# EAGLE design lt8471 (EAGLE 9.5.1)
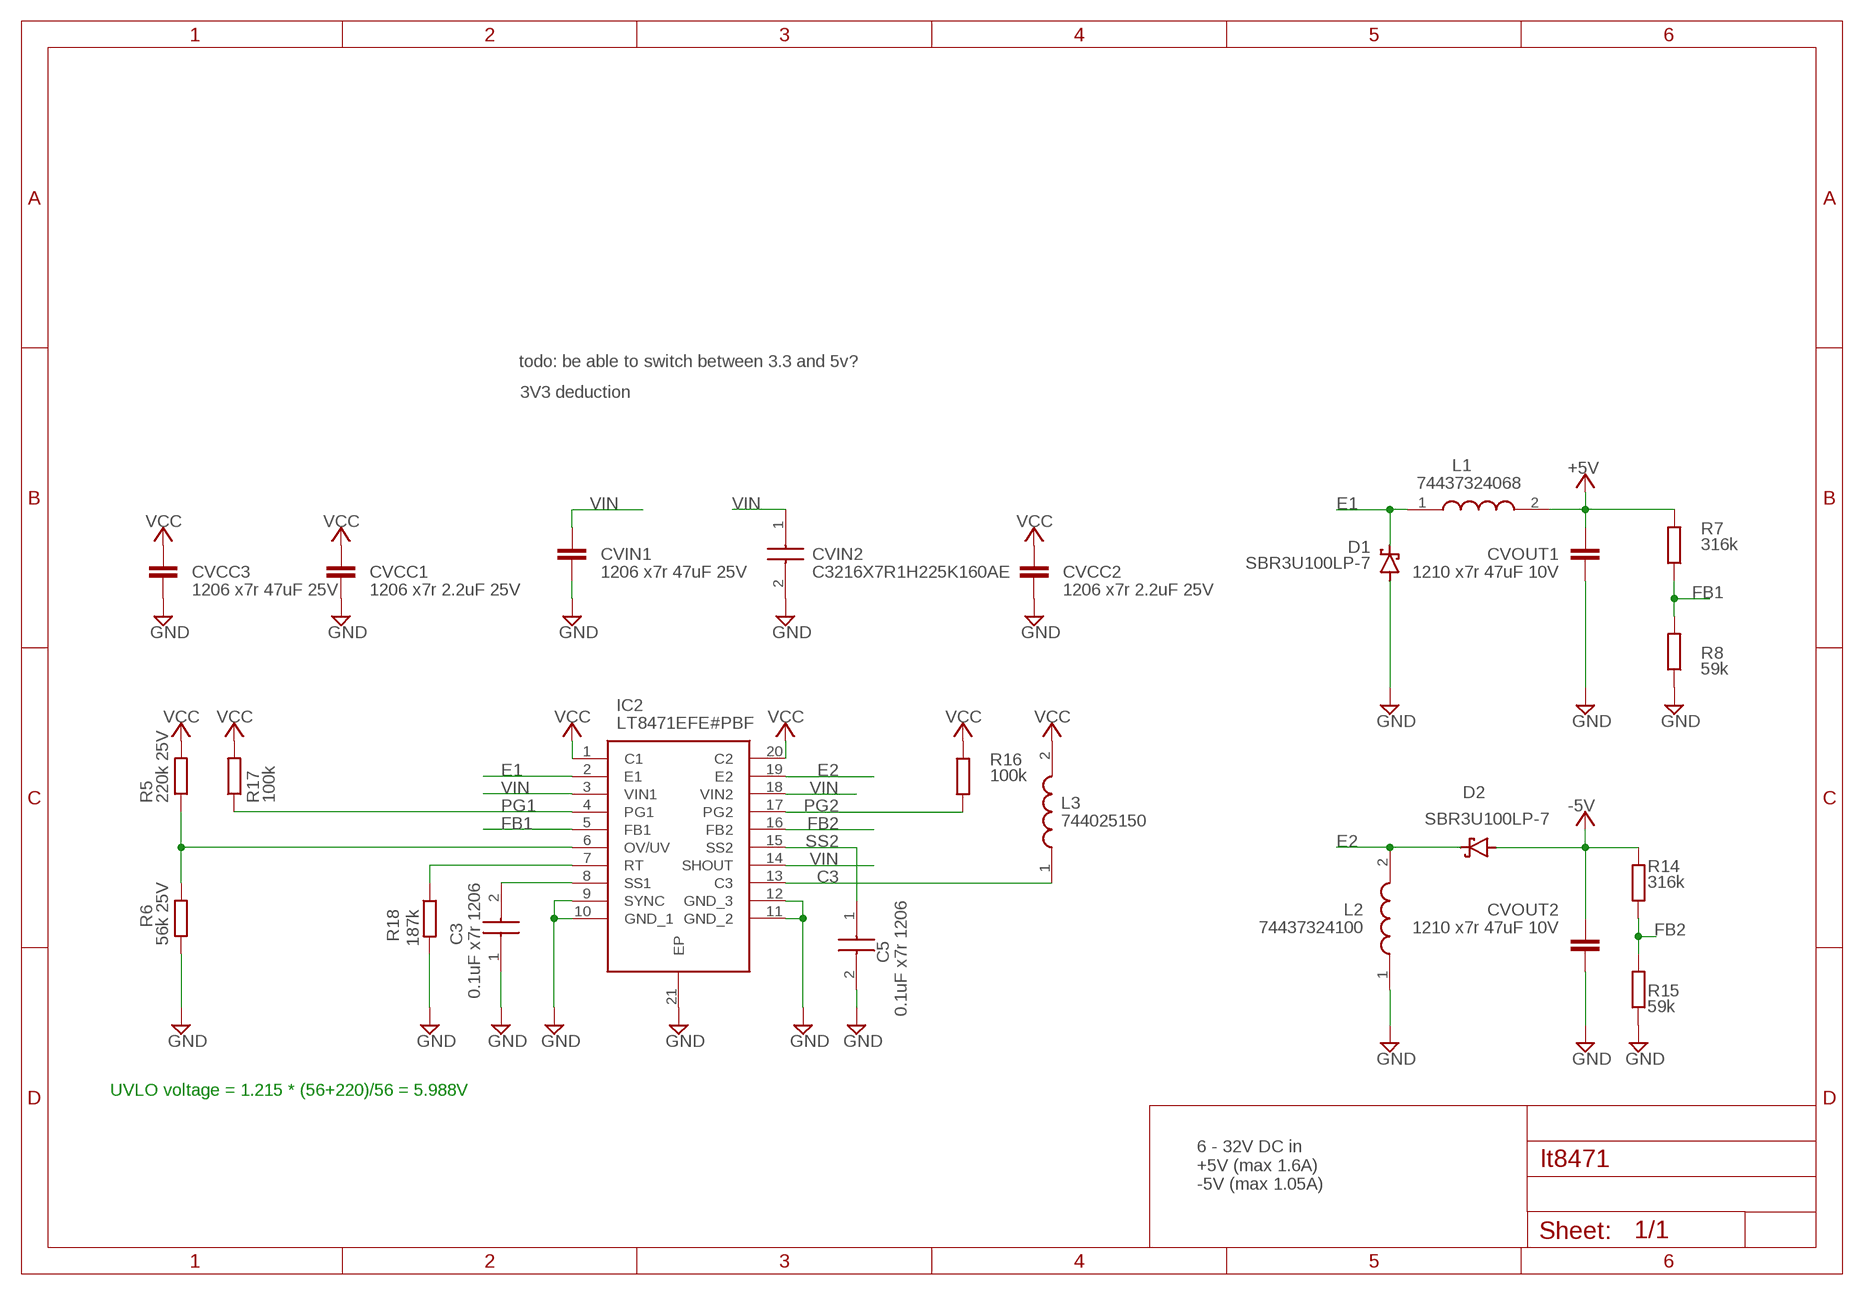
[diagram p0: schematic, sheet 1]

## Parts
C3  0.1uF x7r 1206  MCSH31B104K500CT  [CAPC3416X90N]
C5  0.1uF x7r 1206  MCSH31B104K500CT  [CAPC3416X90N]
CVCC1  1206 x7r 2.2uF 25V  C-EUC1206  [C1206]
CVCC2  1206 x7r 2.2uF 25V  C-EUC1206  [C1206]
CVCC3  1206 x7r 47uF 25V  C-EUC1210  [C1210]
CVIN1  1206 x7r 47uF 25V  C-EUC1210  [C1210]
CVIN2  C3216X7R1H225K160AE  [CAPC3216X180N]
CVOUT1  1210 x7r 47uF 10V  C-EUC1210  [C1210]
CVOUT2  1210 x7r 47uF 10V  C-EUC1210  [C1210]
D1  SBR3U100LP-7  [SBR3U100LP7]
D2  SBR3U100LP-7  [SBR3U100LP7]
IC2  LT8471EFE#PBF  [SOP65P640X120-21N]
L1  74437324068  [WE-LHMI_402048]
L2  74437324100  [WE-LHMI_402048]
L3  744025150  [WE-TPC_282892]
R5  220k 25V  R-EU_M1206  [M1206]
R6  56k 25V  R-EU_M1206  [M1206]
R7  316k  R-EU_R1206  [R1206]
R8  59k  R-EU_R1206  [R1206]
R14  316k  R-EU_R1206  [R1206]
R15  59k  R-EU_R1206  [R1206]
R16  100k  R-EU_R1206  [R1206]
R17  100k  R-EU_R1206  [R1206]
R18  187k  R-EU_R1206  [R1206]

## Nets
+5V: CVOUT1.2 L1.2 R7.2
-5V: CVOUT2.2 D2.1(A) D2.2(A) D2.3(A) D2.4(A) R14.2
C3: IC2.13(C3) L3.1
E1 [switching]: D1.5(C) IC2.2(E1) L1.1
E2 [power]: D2.5(C) IC2.19(E2) L2.2
FB1: IC2.5(FB1) R7.1 R8.2
FB2: IC2.16(FB2) R14.1 R15.2
GND [power]: C3.1 C5.2 CVCC1.2 CVCC2.1 CVCC3.1 CVIN1.2 CVIN2.2 CVOUT1.1 CVOUT2.1 D1.1(A) D1.2(A) D1.3(A) D1.4(A) IC2.9(SYNC) IC2.10(GND_1) IC2.11(GND_2) IC2.12(GND_3) IC2.21(EP) L2.1 R6.1 R8.1 R15.1 R18.2
N$1: IC2.7(RT) R18.1
N$4: IC2.6(OV/UV) R5.1 R6.2
PG1: IC2.4(PG1) R17.1
PG2: IC2.17(PG2) R16.2
SS1: C3.2 IC2.8(SS1)
SS2: C5.1 IC2.15(SS2)
VCC [power]: CVCC1.1 CVCC2.2 CVCC3.2 IC2.1(C1) IC2.20(C2) L3.2 R5.2 R16.1 R17.2
VIN: CVIN1.1 CVIN2.1 IC2.3(VIN1) IC2.14(SHOUT) IC2.18(VIN2)

## Notes on the sheet
- todo: be able to switch between 3.3 and 5v?
- 3V3 deduction
- UVLO voltage = 1.215 * (56+220)/56 = 5.988V
- 6 - 32V DC in
  +5V (max 1.6A)
  -5V (max 1.05A)

## Library data of the parts
C3 C5 = samacsys:MCSH31B104K500CT: MULTICOMP - MCSH31B104K500CT - CAP, MLCC, X7R, 100NF, 50V, 1206 Source: Datasheet <http://www.farnell.com/datasheets/1825494.pdf>; DESCRIPTION: MULTICOMP - MCSH31B104K500CT - CAP, MLCC, X7R, 100NF, 50V, 1206; HEIGHT: 0.9mm; MANUFACTURER_NAME: MULTICOMP; MANUFACTURER_PART_NUMBER: MCSH31B104K500CT
CVCC1-CVCC3 CVIN1 CVOUT1 CVOUT2 = rcl:C-EU: CAPACITOR, European symbol; SPICEPREFIX: C
CVIN2 = samacsys:C3216X7R1H225K160AE: Multilayer Ceramic Capacitors MLCC - SMD/SMT 3216 2.2uF 50volts X7R 10% Soft Term Source: Datasheet <https://product.tdk.com/info/en/catalog/datasheets/mlcc_commercial_midvoltage_en.pdf>; DESCRIPTION: Multilayer Ceramic Capacitors MLCC - SMD/SMT 3216 2.2uF 50volts X7R 10% Soft Term; HEIGHT: 1.8mm; MANUFACTURER_NAME: TDK; MANUFACTURER_PART_NUMBER: C3216X7R1H225K160AE; MOUSER_PART_NUMBER: 810-C3216X7R1H225KST; MOUSER_PRICE-STOCK: http://www.mouser.com/Search/ProductDetail.aspx?qs=LcTL%2f5vFEzF%2fV37W3zk7cA%3d%3d
D1 D2 = wouter:SBR3U100LP-7: Diodes Inc SBR3U100LP-7 Switching Diode, 8-Pin U-DFN3030 Source: Datasheet <https://www.diodes.com/assets/Datasheets/SBR3U100LP.pdf>; DESCRIPTION: Diodes Inc SBR3U100LP-7 Switching Diode, 8-Pin U-DFN3030; HEIGHT: 0.63mm; MANUFACTURER_NAME: Diodes Inc.; MANUFACTURER_PART_NUMBER: SBR3U100LP-7; MOUSER_PART_NUMBER: 621-SBR3U100LP-7; MOUSER_PRICE-STOCK: https://www.mouser.com/Search/Refine.aspx?Keyword=621-SBR3U100LP-7; RS_PART_NUMBER: 8855599P; RS_PRICE-STOCK: http://uk.rs-online.com/web/p/products/8855599P
IC2 = samacsys:LT8471EFE#PBF: Linear Technology LT8471EFE#PBF, Dual, DC-DC DC-DC Converter, Adjustable, 1.35A 20-Pin, TSSOP Source: Datasheet <https://www.analog.com/media/en/technical-documentation/data-sheets/8471fd.pdf>; DESCRIPTION: Linear Technology LT8471EFE#PBF, Dual, DC-DC DC-DC Converter, Adjustable, 1.35A 20-Pin, TSSOP; HEIGHT: 1.2mm; MANUFACTURER_NAME: Linear Technology; MANUFACTURER_PART_NUMBER: LT8471EFE#PBF; MOUSER_PART_NUMBER: 584-LT8471EFE#PBF; MOUSER_PRICE-STOCK: https://www.mouser.com/Search/Refine.aspx?Keyword=584-LT8471EFE%23PBF; RS_PART_NUMBER: 1513320; RS_PRICE-STOCK: http://uk.rs-online.com/web/p/products/1513320
L1 = samacsys:74437324068: SMD Power Inductor WE-LHMI Source: Datasheet <http://componentsearchengine.com/Datasheets/1/74437324068.pdf>; DESCRIPTION: SMD Power Inductor WE-LHMI; HEIGHT: mm; MANUFACTURER_NAME: Wurth Elektronik; MANUFACTURER_PART_NUMBER: 74437324068; MOUSER_PART_NUMBER: 710-74437324068; MOUSER_PRICE-STOCK: https://www.mouser.com/Search/Refine.aspx?Keyword=710-74437324068; RS_PART_NUMBER: 7568480P; RS_PRICE-STOCK: http://uk.rs-online.com/web/p/products/7568480P
L2 = samacsys:74437324100: SMD Power Inductor WE-LHMI Source: Datasheet <http://componentsearchengine.com/Datasheets/1/74437324100.pdf>; DESCRIPTION: SMD Power Inductor WE-LHMI; HEIGHT: mm; MANUFACTURER_NAME: Wurth Elektronik; MANUFACTURER_PART_NUMBER: 74437324100; MOUSER_PART_NUMBER: 710-74437324100; MOUSER_PRICE-STOCK: https://www.mouser.com/Search/Refine.aspx?Keyword=710-74437324100; RS_PART_NUMBER: 7568487P; RS_PRICE-STOCK: http://uk.rs-online.com/web/p/products/7568487P
L3 = samacsys:744025150: Wurth WE-TPC Series Shielded Wire-wound SMD Inductor with a Ferrite Core, 15 H 20% 900mA Idc Source: Datasheet; DESCRIPTION: Wurth WE-TPC Series Shielded Wire-wound SMD Inductor with a Ferrite Core, 15 H 20% 900mA Idc; HEIGHT: mm; MANUFACTURER_NAME: Wurth Elektronik; MANUFACTURER_PART_NUMBER: 744025150; MOUSER_PART_NUMBER: 710-744025150; MOUSER_PRICE-STOCK: https://www.mouser.com/Search/Refine.aspx?Keyword=710-744025150; RS_PART_NUMBER: 7373639P; RS_PRICE-STOCK: http://uk.rs-online.com/web/p/products/7373639P
R5 R6 = resistor:R-EU_: RESISTOR, European symbol
R7 R8 R14-R18 = rcl:R-EU_: RESISTOR, European symbol; SPICEPREFIX: R

## Net classes
1 switching: width 0.3 mm
2 power: width 0.4 mm

## Board
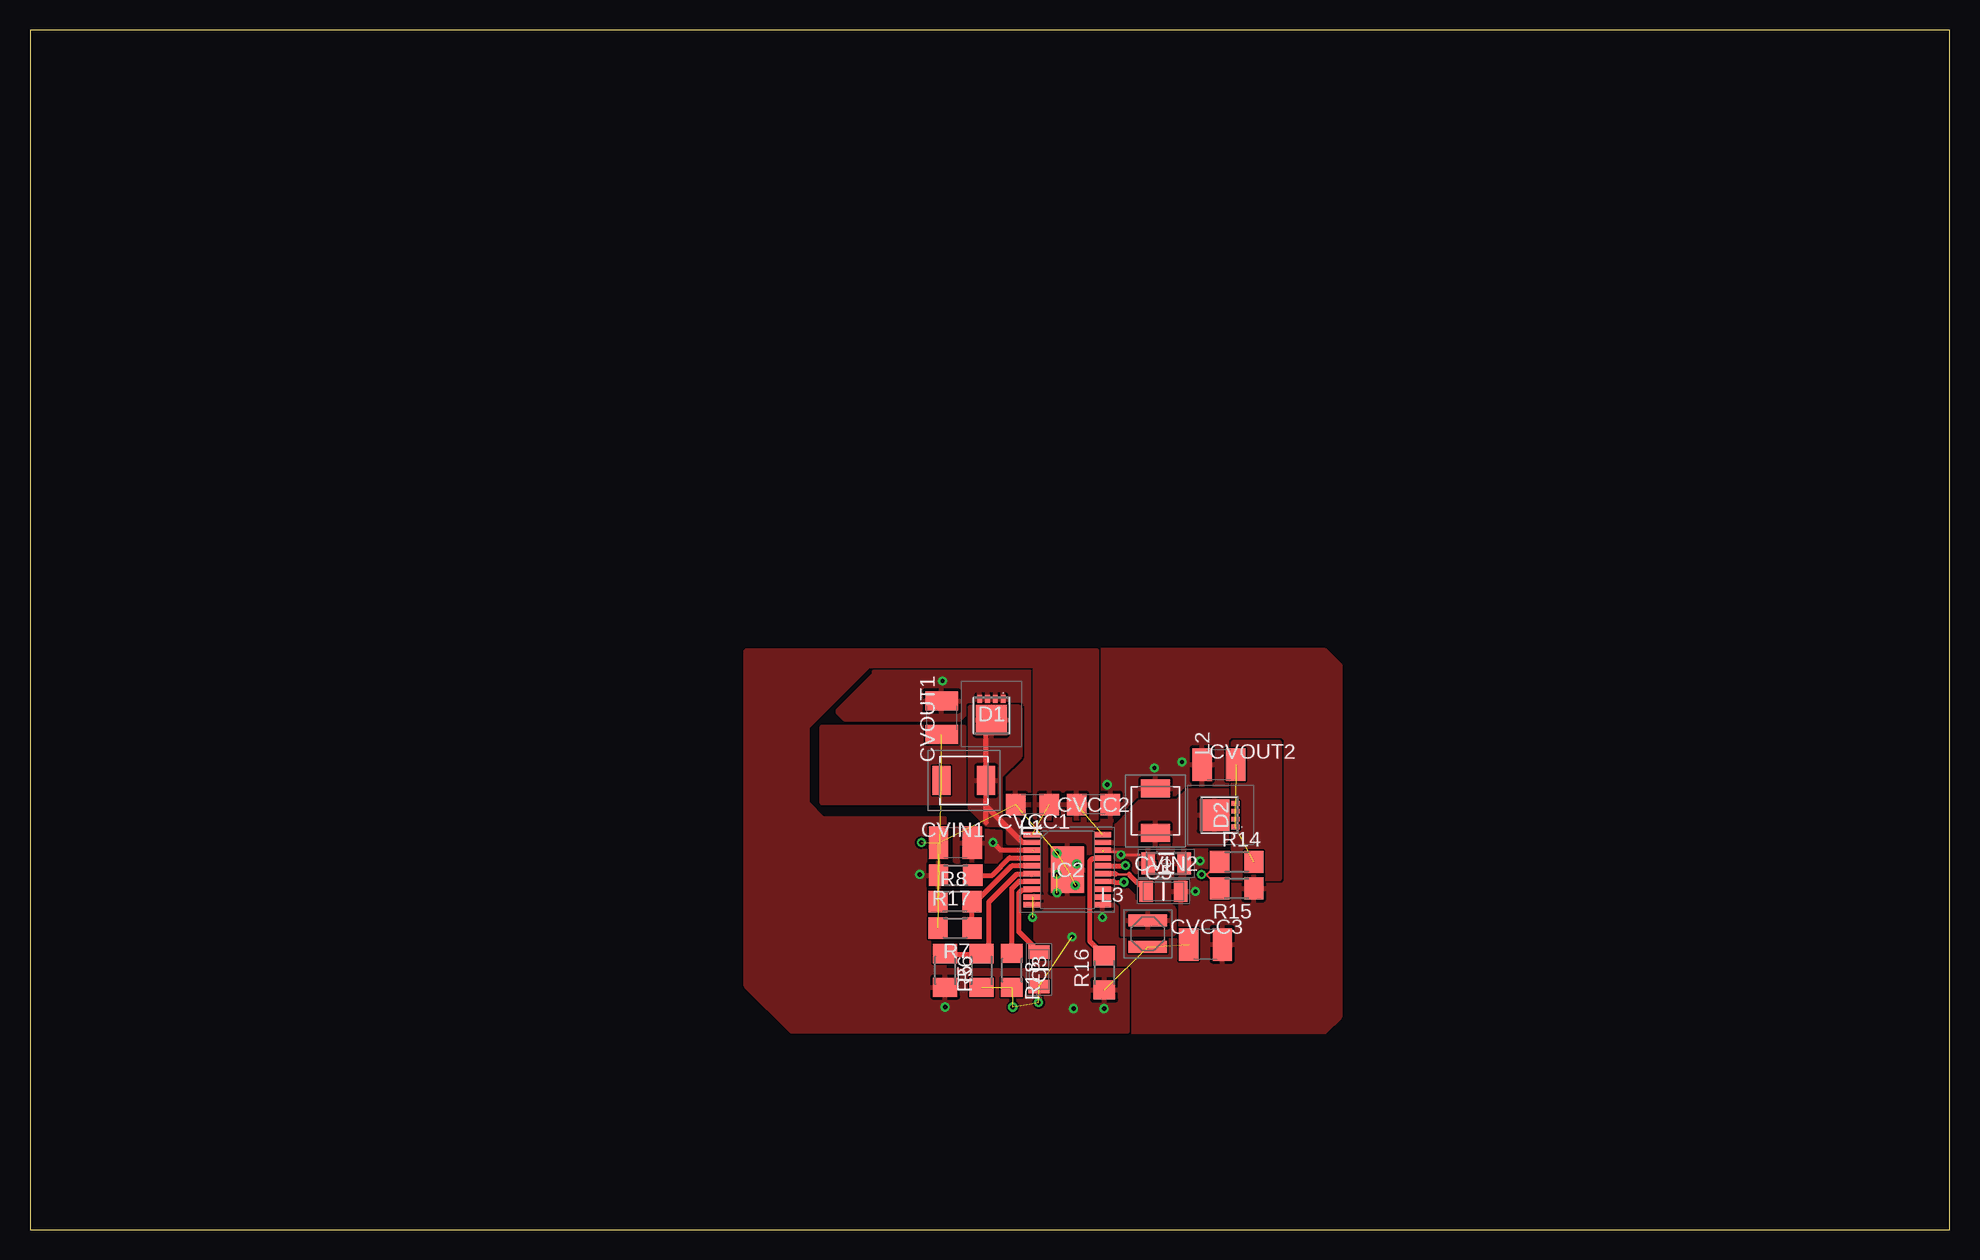
[diagram p1: board, top side]
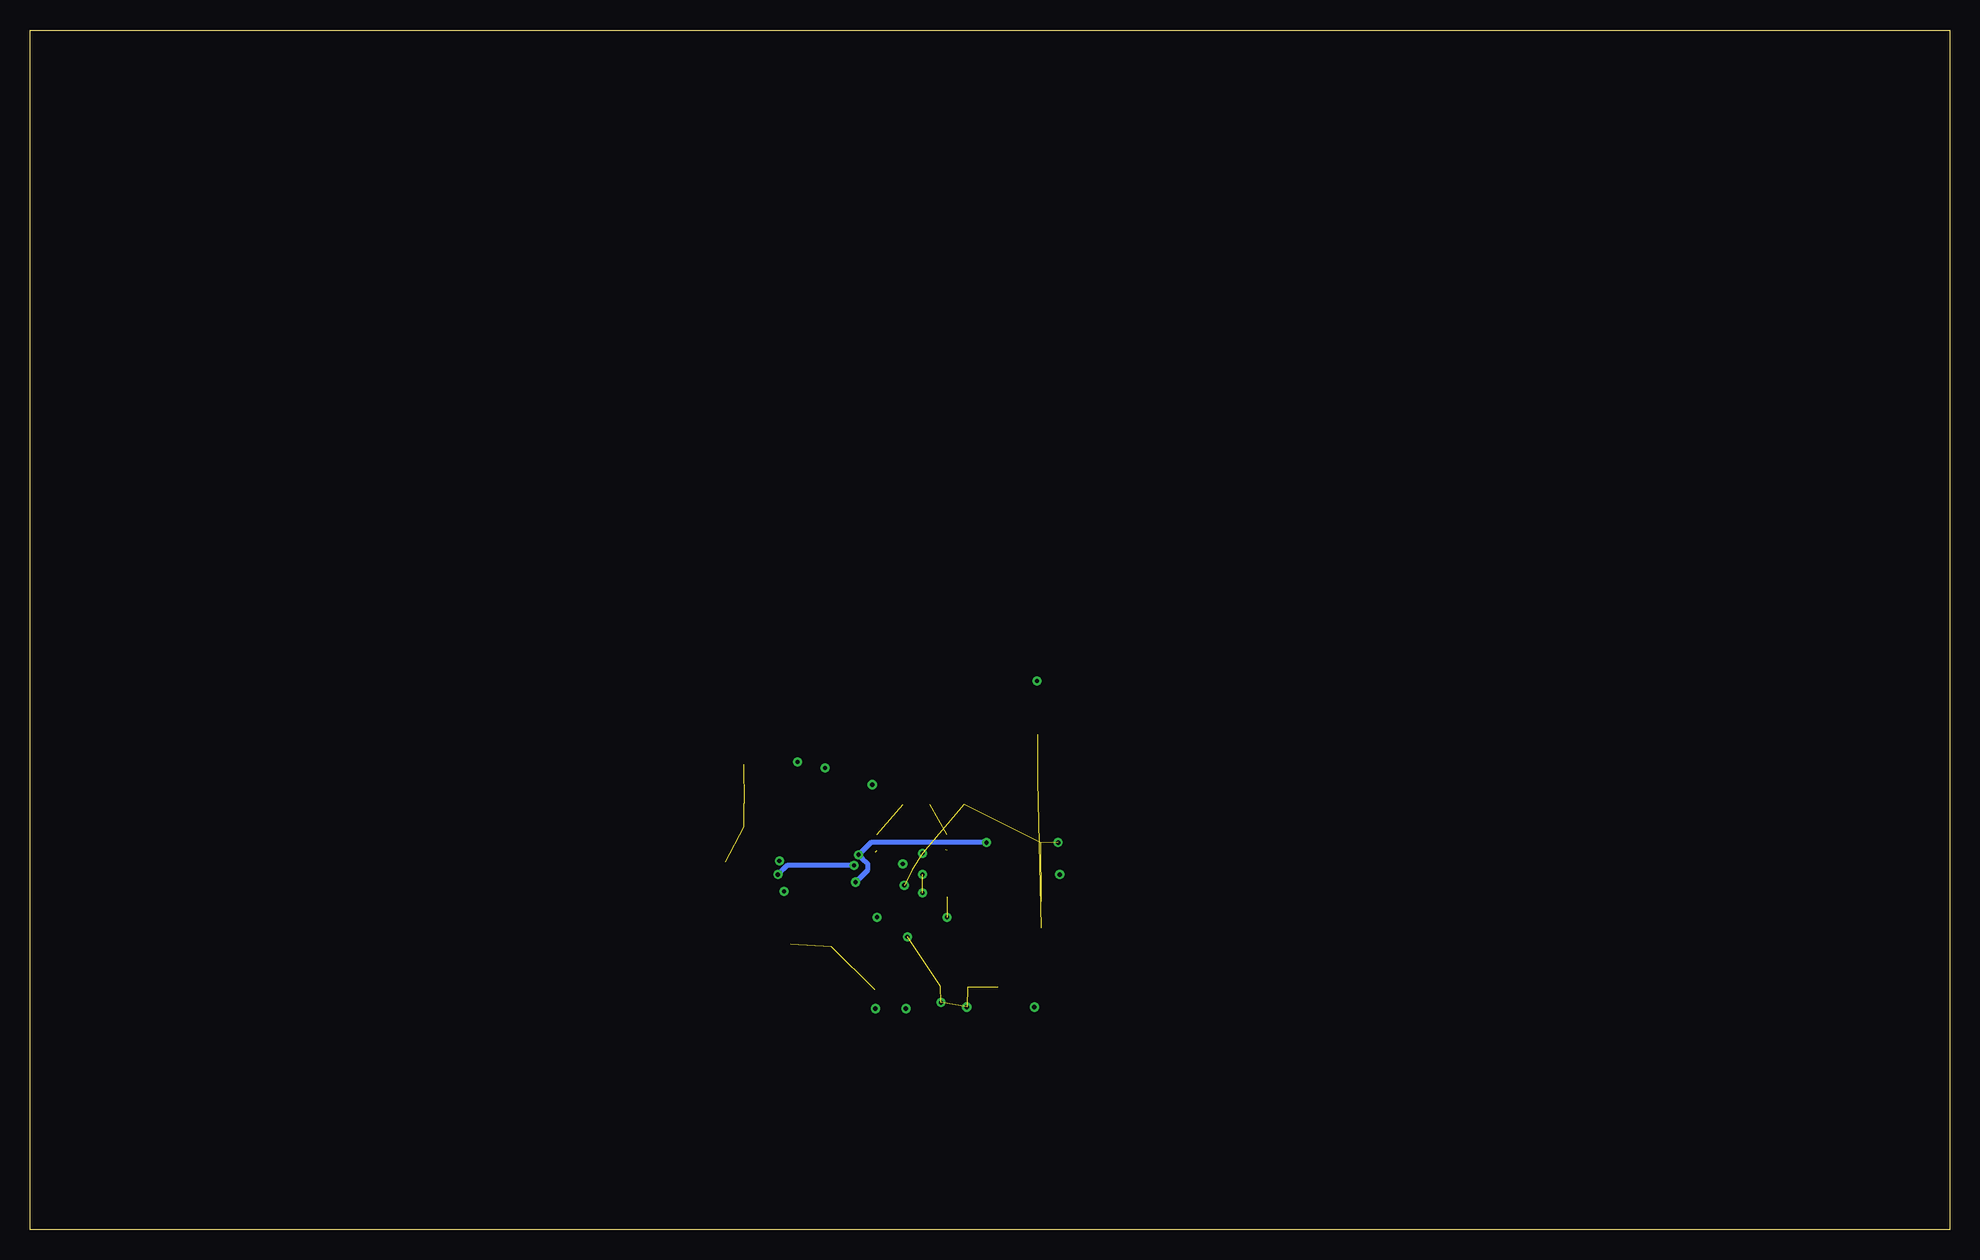
[diagram p2: board, bottom side, seen from below]

Size 160 x 100 mm. Coordinates in mm from the lower left corner, seen from the top.
Outline: 0,0 160,0 160,100 0,100 0,0
Copper layers (1*16): Top 0.035mm / dielectric 0.15mm / Bottom 0.035mm
Design rules "default": minimum track width 6mil, minimum drill 0.35mm, track to track 6mil, track to pad 6mil, pad to pad 6mil, via to via 6mil, smd to smd 6mil, copper to edge 40mil, drill to drill 6mil, minimum pad ring 10mil, minimum via ring 8mil, stop-mask expansion 4mil, vias tented up to drill 0mil, thermal gap 10mil

### Footprints (pad centres in the part's own frame; a part is rotated, then mirrored left to right if it is on the bottom)
CAPC3416X90N = smd 1.13 x 1.78: 1 -1.44,0; 2 1.44,0
C1206 = smd 1.6 x 1.8: 1 -1.4,0; 2 1.4,0
C1210 = smd 1.6 x 2.7: 1 -1.4,0; 2 1.4,0
CAPC3216X180N = smd 1.15 x 1.8: 1 -1.5,0; 2 1.5,0
SBR3U100LP7 = smd 0.39 x 0.65: 1 -0.975,-1.165; 2 -0.325,-1.165; 3 0.325,-1.165; 4 0.975,-1.165 | smd 2.59 x 2.49: 5 0,0.565
SOP65P640X120-21N = smd 1.45 x 0.45: 1 -2.925,2.925; 2 -2.925,2.275; 3 -2.925,1.625; 4 -2.925,0.975; 5 -2.925,0.325; 6 -2.925,-0.325; 7 -2.925,-0.975; 8 -2.925,-1.625; 9 -2.925,-2.275; 10 -2.925,-2.925; 11 2.925,-2.925; 12 2.925,-2.275; 13 2.925,-1.625; 14 2.925,-0.975; 15 2.925,-0.325; 16 2.925,0.325; 17 2.925,0.975; 18 2.925,1.625; 19 2.925,2.275; 20 2.925,2.925 | smd 2.74 x 3.86: 21 0,0
WE-LHMI_402048 = smd 1.5 x 2.4: 1 -1.85,0; 2 1.85,0
WE-TPC_282892 = smd 3.2 x 1: 1 0,1.1; 2 0,-1.1
M1206 = smd 1.6 x 2: 1 -1.4,0; 2 1.4,0
R1206 = smd 1.6 x 1.803: 1 -1.422,0; 2 1.422,0

### Placement (x,y rotation side)
C3  84.1,21.69 90 top
C5  94.48,28.19 0 top
CVCC1  83.57,35.43 180 top
CVCC2  88.65,35.43 180 top
CVCC3  97.98,23.76 180 top
CVIN1  77.14,32.24 180 top
CVIN2  94.7,30.52 0 top
CVOUT1  75.99,42.66 270 top
CVOUT2  99.11,38.76 0 top
D1  80.14,43.05 180 top
D2  99.31,34.54 90 top
IC2  86.47,30 0 top
L1  77.84,37.43 180 top
L2  93.81,34.91 270 top
L3  93.18,24.66 0 top
R5  76.29,21.6 270 top
R6  79.31,21.6 90 top
R7  77.1,25.14 180 top
R8  77.1,27.34 0 top
R14  100.59,30.64 0 top
R15  100.59,28.44 180 top
R16  89.55,21.41 90 top
R17  77.16,29.54 180 top
R18  81.84,21.6 270 top

### Tracks (layer width: path | path; a pad name or v marks a point on that pad's centre or on a via)
+5V  (2 unrouted)
-5V  (5 unrouted)
C3
  pour Top: 90.04,28.19 91.06,27.18 91.06,24.64 95.25,24.64 95.38,24.77 95.38,26.67 95.25,26.8 95.12,26.92 92.46,26.92 91.95,27.43 91.95,27.81 91.31,28.45 91.19,28.45 89.92,28.45 90.04,28.32
E1
  Top 0.4: 79.69,33.94 L1.1 | L1.1 79.69,42.04 D1.5 | IC2.2 83.52,32.25 82.77,32.25 79.69,35.33 L1.1
  pour Top: 78.36,43.43 78.36,35.18 79.5,34.04 79.76,33.78 81.28,33.78 81.53,33.53 81.53,32.26 82.55,32.26 82.8,32.26 82.55,32.51 82.55,32.89 82.42,33.02 82.42,34.04 82.3,34.16 80.64,34.16 80.9,34.42 80.9,37.85 82.55,39.5 82.55,43.43 82.42,43.56 78.36,43.56 78.74,43.18
E2
  pour Top (isolate 0.051, rank 2): 89.92,32.13 99.31,32.13 99.95,32.77 99.95,36.45 99.82,36.58 96.52,36.58 95.63,35.69 92.58,35.69 91.82,34.92 90.55,33.66 90.55,32.77
FB1
  Top 0.4: R7.1 R8.2 78.87,27.34 81.78,30.25 81.86,30.32 IC2.5
FB2  (via drill 0.35)
  Top 0.2: R14.1 98.11,29.59 v97.66,29.59 98.02,29.59 R15.2
  Top 0.4: IC2.16 91.28,30.32 v91.31,30.35
  Bottom 0.4: v91.31,30.35 96.88,30.35 97.23,30 97.25,30 v97.66,29.59
GND  (via drill 0.35)  (14 unrouted)
  other vias: 87.12,28.7 85.6,29.59 85.6,31.37 85.6,28.07 97.54,30.73 97.16,28.19 86.87,24.38 83.57,26.04 89.41,26.04 81.92,18.54 84.07,18.92 93.73,38.48 89.79,37.08 76.07,45.72 96.01,38.99 74.3,32.26
  pour Top (isolate 0.051, rank 3): 83.82,45.72 83.82,17.78 85.09,16.51 107.95,16.51 109.22,17.78 109.22,46.99 107.95,48.26 86.36,48.26
  pour Top (isolate 0.051, rank 3): 69.85,45.72 67.31,43.18 67.94,42.55 73.91,42.55 77.47,42.55 77.85,42.93 78.87,43.94 82.3,43.94 82.8,43.94 83.06,43.69 83.06,39.24 81.53,37.72 81.53,37.59 81.53,34.8 81.66,34.67 83.44,34.67 83.44,46.48 70.36,46.48 70.36,46.23
N5V
  pour Top: 100.33,29.21 100.33,40.64 104.14,40.64 104.14,29.21
N$1
  Top 0.4: R18.1 81.84,28.44 82.42,29.02 IC2.7
N$3  (via drill 0.35)
  other vias: 87.25,30.48
N$4
  Top 0.152: R5.1 R6.2
  Top 0.4: IC2.6 83.47,29.6 82.22,29.6 79.9,27.28 79.9,22.9 76.39,22.9 R5.1
P5V
  pour Top (isolate 0.051, rank 2): 77.85,41.91 77.85,35.56 66.04,35.56 66.04,41.91
PG1
  Top 0.4: R17.1 80.21,29.54 81.66,30.99 83.53,30.99 IC2.4
PG2
  Top 0.4: IC2.17 89.32,30.9 88.52,30.9 88.32,30.7 88.32,24.06 R16.2
SS1
  Top 0.4: C3.2 82.43,24.8 82.43,28.06 82.67,28.3 83.47,28.3 IC2.8
SS2
  Top 0.2: 90.5,29.62 91.61,29.62
  Top 0.4: IC2.15 90.45,29.68 90.5,29.62 | 91.61,29.62 C5.1
VCC  (via drill 0.35)  (4 unrouted)
  other vias: 74.17,29.59 76.29,18.54 87,18.41 89.53,18.41
  pour Top: 88.9,48.26 88.9,34.29 83.82,34.29 83.82,46.99 69.85,46.99 64.77,41.91 64.77,35.56 66.04,34.29 76.2,34.29 76.2,21.59 91.44,21.59 91.44,16.51 63.5,16.51 59.69,20.32 59.69,48.26
VIN  (via drill 0.35)  (2 unrouted)
  Top 0.2: 92.48,31.24 v90.93,31.24 90.68,31.5 89.52,31.5
  Top 0.4: IC2.14 90.32,29.02 90.4,28.94 91.17,28.94 v91.19,28.96 | v80.26,32.26 80.87,31.65 83.67,31.65
  Bottom 0.4: v91.19,28.96 91.17,28.96 90.2,29.92 90.2,30.53 90.63,30.96 90.65,30.96 v90.93,31.24 89.92,32.26 v80.26,32.26
  pour Top: 77.09,33.44 77.09,30.73 80.9,30.73 80.9,33.11
  pour Top: 90.04,31.5 90.42,31.5 90.42,31.11 90.68,30.86 91.19,30.86 91.69,30.35 92.46,29.59 93.73,29.59 93.73,31.75 93.6,31.62 90.04,31.62